# EAGLE schematic Roland+memser (EAGLE 6.6.0)

## Sheet 1 of 5
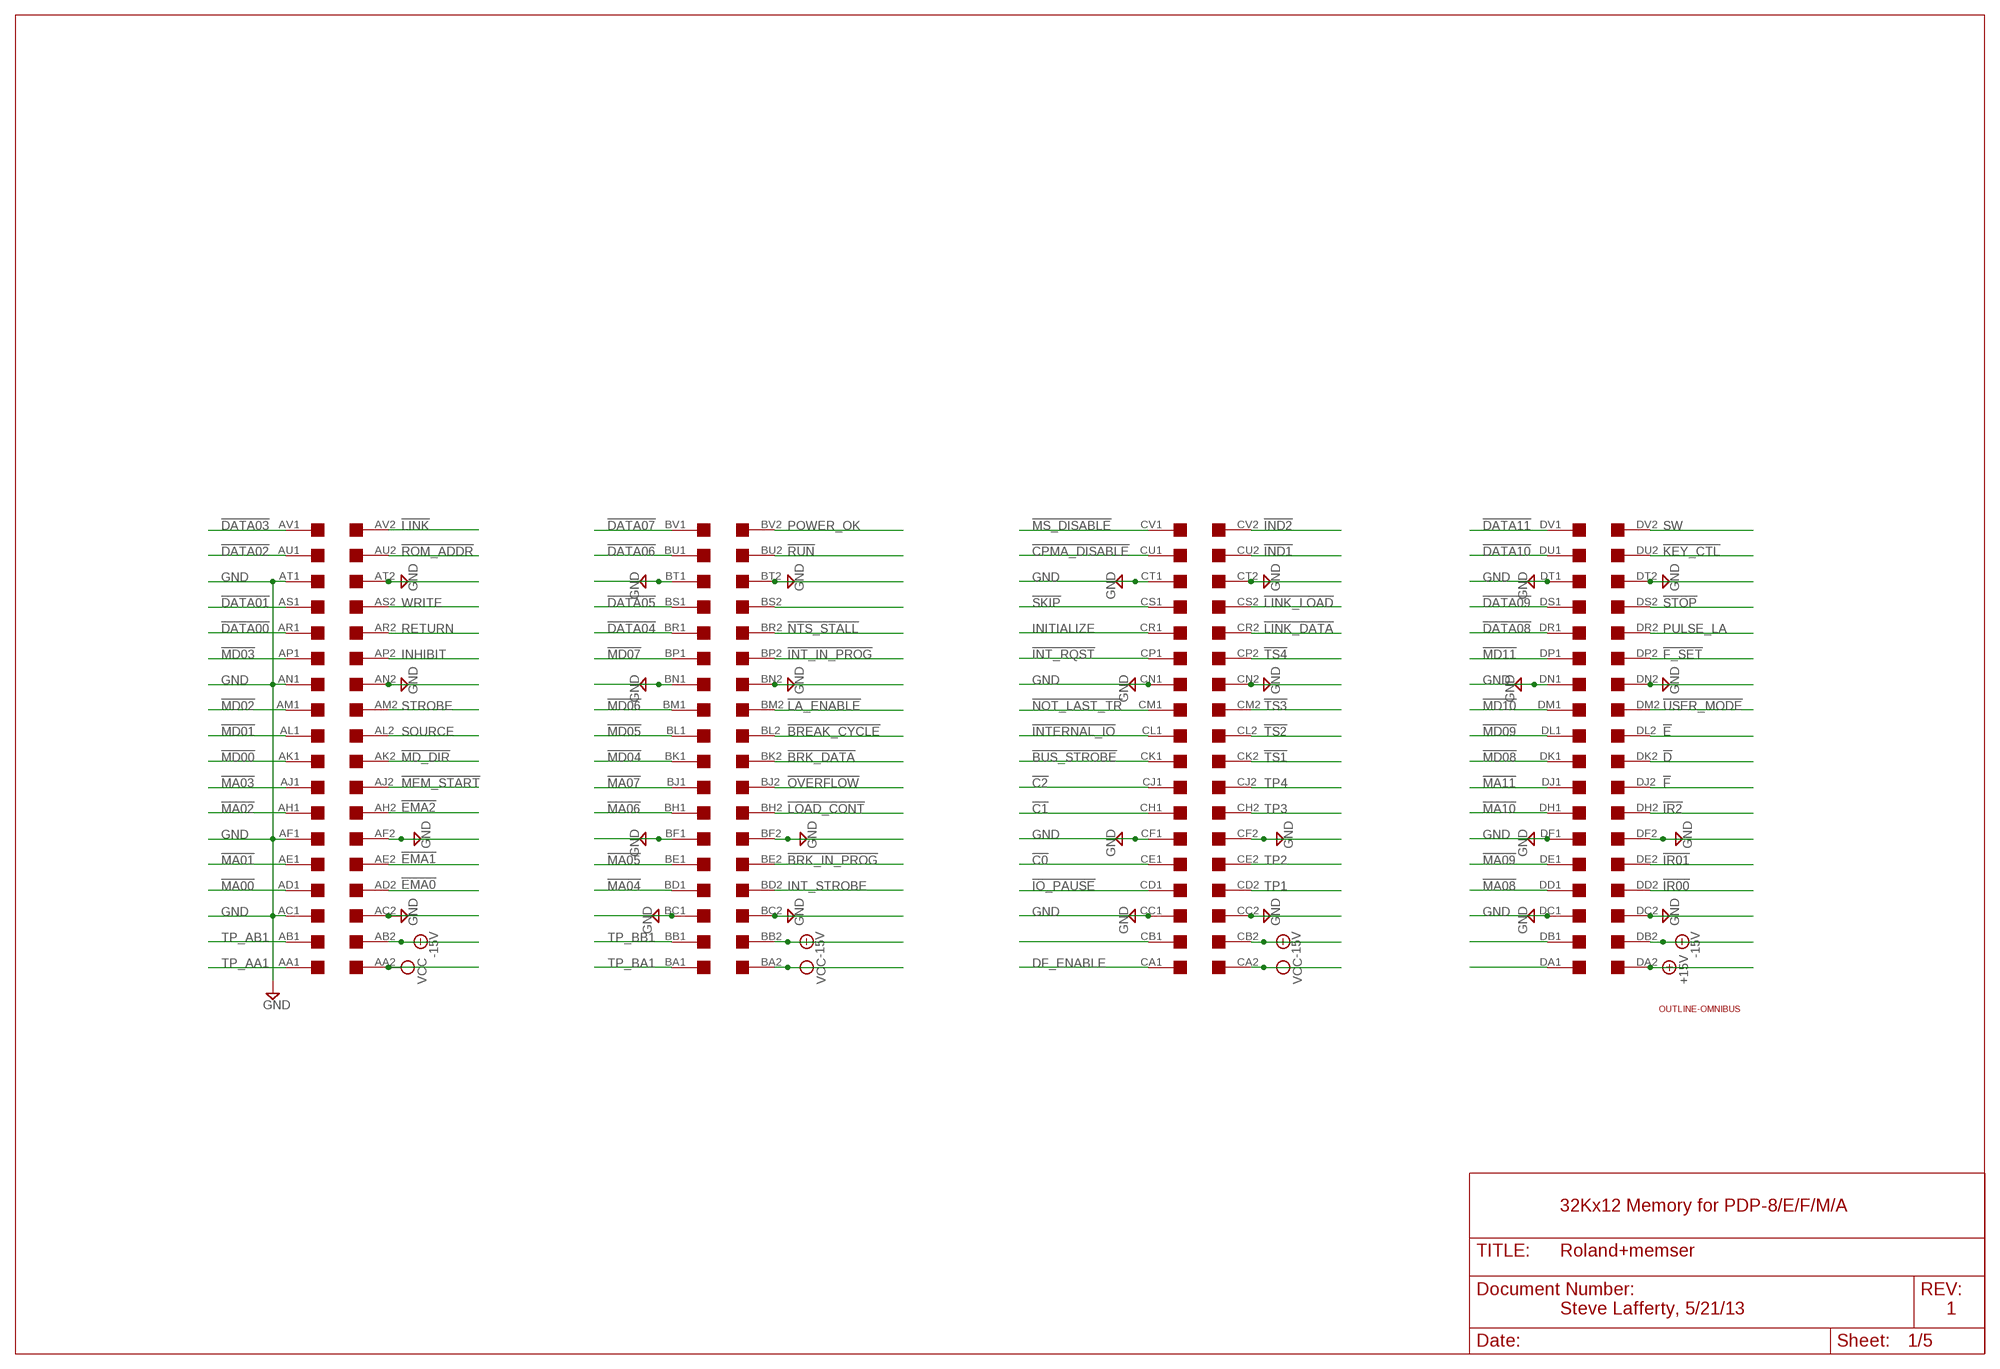
[diagram p0: schematic, sheet 1]

### Parts
J1  EDGE  QUAD  [EDGE-CON8]
U$1  OUTLINE-OMNIBUS  [OMNIBUS]

### Nets
!BREAK_CYCLE: J1.BL2
!BRK_DATA: J1.BK2 ; also sheet 2
!BRK_IN_PROG: J1.BE2
!BUS_STROBE: J1.CK1
!C0: J1.CE1 ; also sheet 5
!C1: J1.CH1 ; also sheet 5
!C2: J1.CJ1
!CPMA_DISABLE: J1.CU1 ; also sheet 5
!D: J1.DK2 ; also sheet 5
!DATA00: J1.AR1 ; also sheet 2,5
!DATA01: J1.AS1 ; also sheet 2,5
!DATA02: J1.AU1 ; also sheet 2,5
!DATA03: J1.AV1 ; also sheet 2,5
!DATA04: J1.BR1 ; also sheet 2,5
!DATA05: J1.BS1 ; also sheet 2,5
!DATA06: J1.BU1 ; also sheet 2,5
!DATA07: J1.BV1 ; also sheet 2,5
!DATA08: J1.DR1 ; also sheet 2,5
!DATA09: J1.DS1 ; also sheet 2,5
!DATA10: J1.DU1 ; also sheet 2,5
!DATA11: J1.DV1 ; also sheet 2,5
!E: J1.DL2
!EMA0: J1.AD2 ; also sheet 3,5
!EMA1: J1.AE2 ; also sheet 3,5
!EMA2: J1.AH2 ; also sheet 3,5
!F: J1.DJ2 ; also sheet 5
!F_SET: J1.DP2 ; also sheet 5
!IND1: J1.CU2 ; also sheet 5
!IND2: J1.CV2 ; also sheet 5
!INT_IN_PROG: J1.BP2 ; also sheet 5
!INT_RQST: J1.CP1 ; also sheet 5
!INTERNAL_IO: J1.CL1 ; also sheet 5
!IO_PAUSE: J1.CD1 ; also sheet 5
!IR00: J1.DD2 ; also sheet 5
!IR01: J1.DE2 ; also sheet 5
!IR2: J1.DH2
!KEY_CTL: J1.DU2 ; also sheet 2,5
!LA_ENABLE: J1.BM2 ; also sheet 2
!LINK: J1.AV2
!LINK_DATA: J1.CR2
!LINK_LOAD: J1.CS2
!LOAD_CONT: J1.BH2 ; also sheet 5
!MA00: J1.AD1 ; also sheet 3
!MA01: J1.AE1 ; also sheet 3
!MA02: J1.AH1 ; also sheet 3
!MA03: J1.AJ1 ; also sheet 3
!MA04: J1.BD1 ; also sheet 3
!MA05: J1.BE1 ; also sheet 3
!MA06: J1.BH1 ; also sheet 3
!MA07: J1.BJ1 ; also sheet 3
!MA08: J1.DD1 ; also sheet 3
!MA09: J1.DE1 ; also sheet 3
!MA10: J1.DH1 ; also sheet 3
!MA11: J1.DJ1 ; also sheet 3
!MD00: J1.AK1 ; also sheet 3,5
!MD01: J1.AL1 ; also sheet 3,5
!MD02: J1.AM1 ; also sheet 3,5
!MD03: J1.AP1 ; also sheet 3,5
!MD04: J1.BK1 ; also sheet 3,5
!MD05: J1.BL1 ; also sheet 3,5
!MD06: J1.BM1 ; also sheet 3,5
!MD07: J1.BP1 ; also sheet 3,5
!MD08: J1.DK1 ; also sheet 3,5
!MD09: J1.DL1 ; also sheet 3,5
!MD10: J1.DM1 ; also sheet 3,5
!MD11: J1.DP1 ; also sheet 3,5
!MD_DIR: J1.AK2 ; also sheet 2,3
!MEM_START: J1.AJ2 ; also sheet 2
!MS_DISABLE: J1.CV1 ; also sheet 2
!NOT_LAST_TR: J1.CM1
!NTS_STALL: J1.BR2
!OVERFLOW: J1.BJ2
!ROM_ADDR: J1.AU2 ; also sheet 3
!RUN: J1.BU2 ; also sheet 2,5
!SKIP: J1.CS1 ; also sheet 5
!STOP: J1.DS2 ; also sheet 2
!TS1: J1.CK2 ; also sheet 5
!TS2: J1.CL2
!TS3: J1.CM2 ; also sheet 5
!TS4: J1.CP2 ; also sheet 2
!USER_MODE: J1.DM2 ; also sheet 5
+15V: J1.DA2
-15V [supply]: J1.AB2 J1.BB2 J1.CB2 J1.DB2
DF_ENABLE: J1.CA1 ; also sheet 5
GND [supply]: J1.AC1 J1.AC2 J1.AF1 J1.AF2 J1.AN1 J1.AN2 J1.AT1 J1.AT2 J1.BC1 J1.BC2 J1.BF1 J1.BF2 J1.BN1 J1.BN2 J1.BT1 J1.BT2 J1.CC1 J1.CC2 J1.CF1 J1.CF2 J1.CN1 J1.CN2 J1.CT1 J1.CT2 J1.DC1 J1.DC2 J1.DF1 J1.DF2 J1.DN1 J1.DN2 J1.DT1 J1.DT2 ; also sheet 2,3,4,5
INHIBIT: J1.AP2
INITIALIZE: J1.CR1 ; also sheet 2,5
INT_STROBE: J1.BD2
N$51: J1.BS2
N$52: J1.CB1
N$53: J1.DA1
N$54: J1.DB1
POWER_OK: J1.BV2 ; also sheet 3,5
PULSE_LA: J1.DR2 ; also sheet 2,5
RETURN: J1.AR2
SOURCE: J1.AL2 ; also sheet 3
STROBE: J1.AM2
SW: J1.DV2 ; also sheet 2
TP1: J1.CD2
TP2: J1.CE2 ; also sheet 5
TP3: J1.CH2 ; also sheet 5
TP4: J1.CJ2 ; also sheet 2,3,5
TP_AA1: J1.AA1 ; also sheet 5
TP_AB1: J1.AB1 ; also sheet 5
TP_BA1: J1.BA1 ; also sheet 5
TP_BB1: J1.BB1 ; also sheet 5
VCC [supply]: J1.AA2 J1.BA2 J1.CA2 ; also sheet 2,3,5
WRITE: J1.AS2 ; also sheet 3

### Notes on the sheet
- 32Kx12 Memory for PDP-8/E/F/M/A
- Steve Lafferty, 5/21/13 | 1

## Sheet 2 of 5
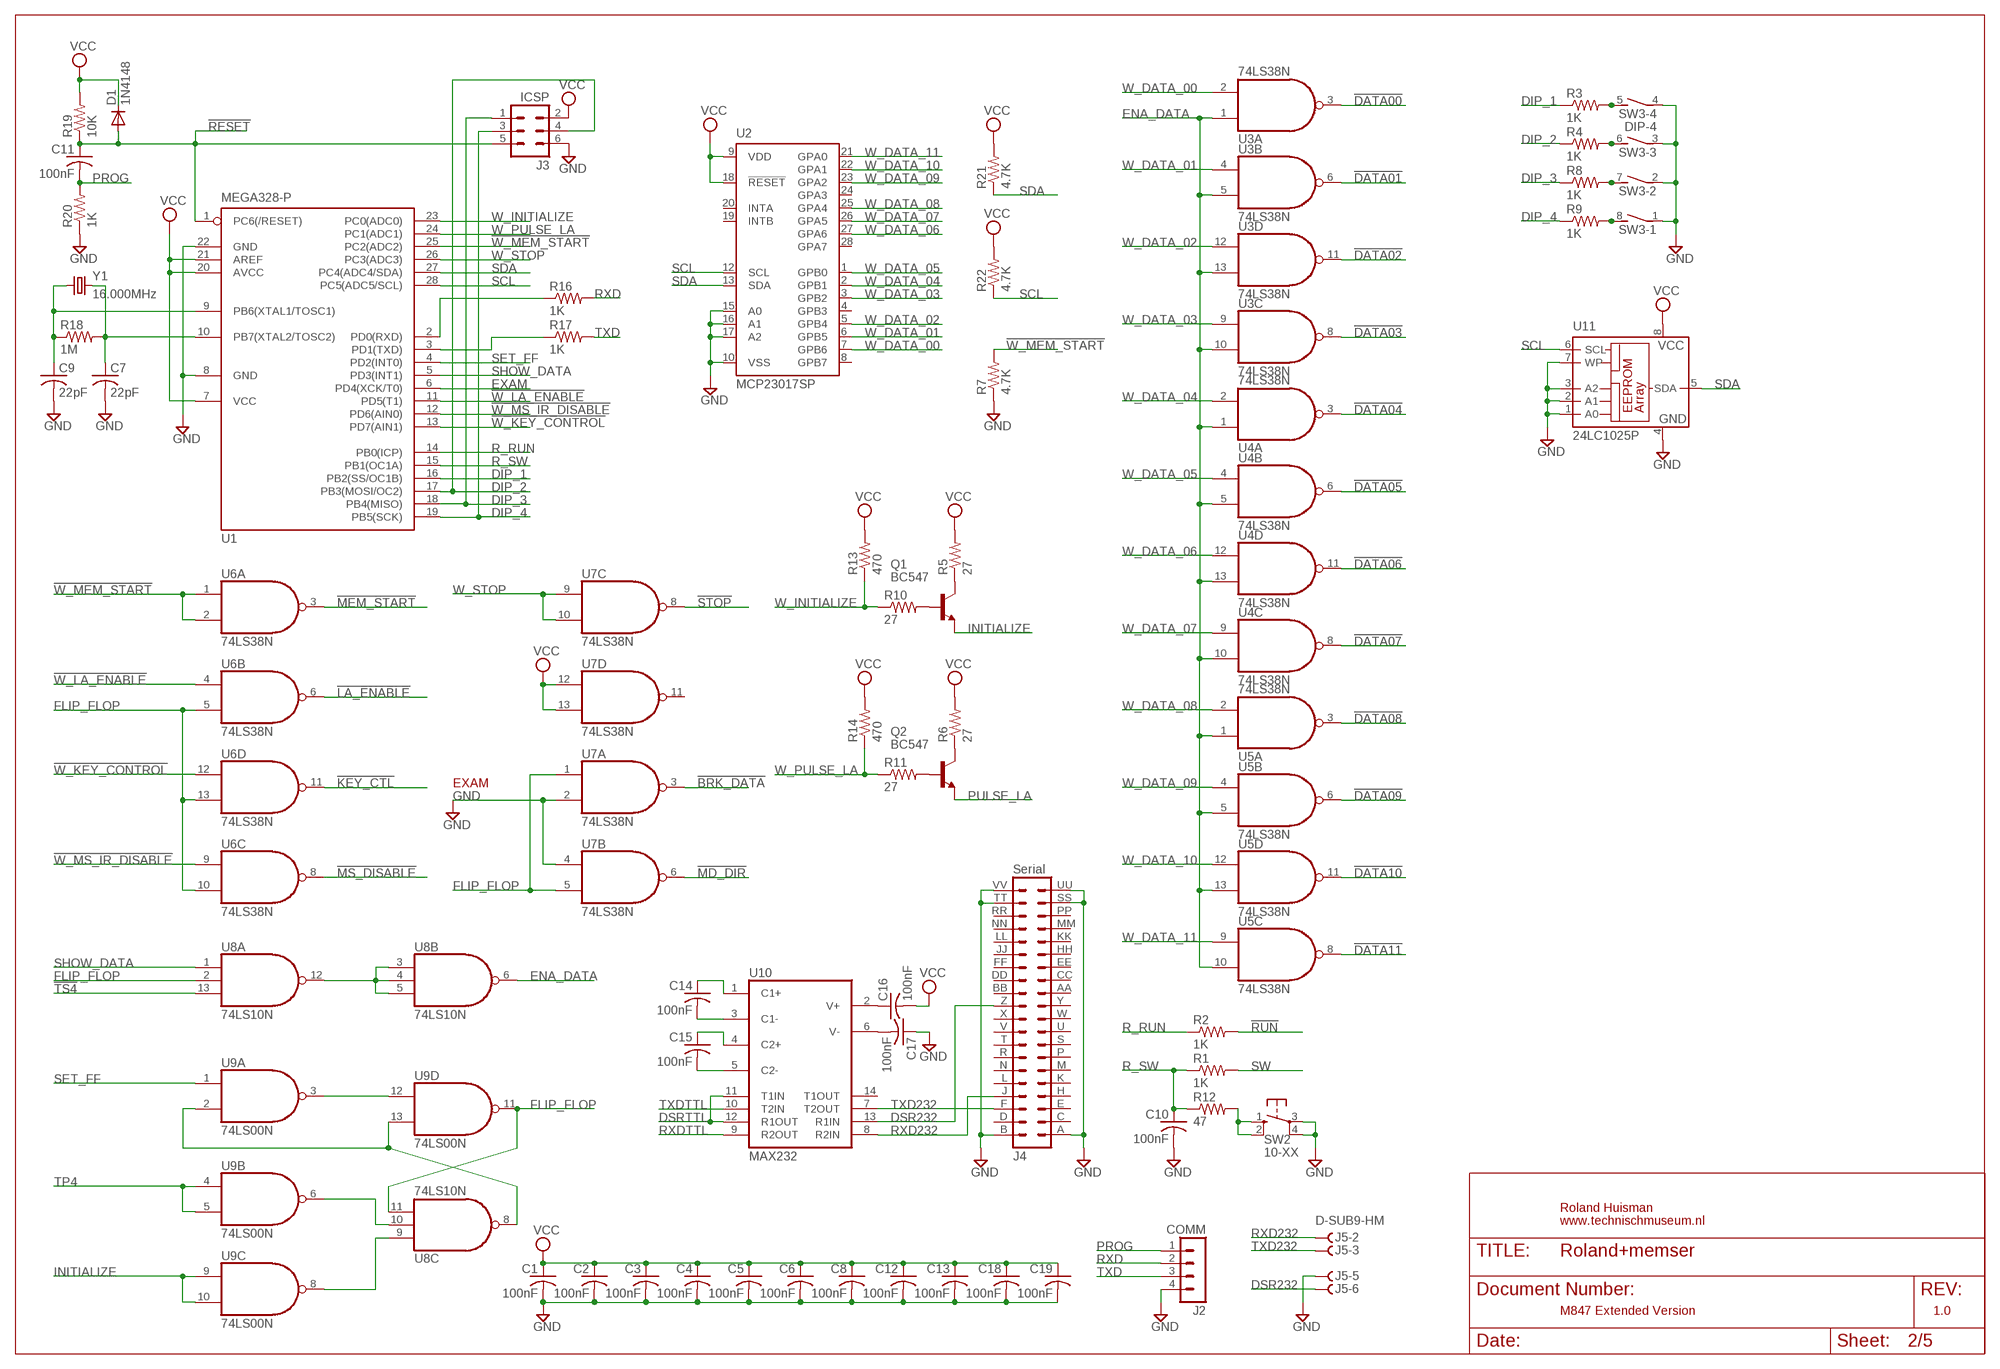
[diagram p1: schematic, sheet 2]

### Parts
C1  100nF  C-US050-025X075  [C050-025X075]
C2  100nF  C-US050-025X075  [C050-025X075]
C3  100nF  C-US050-025X075  [C050-025X075]
C4  100nF  C-US050-025X075  [C050-025X075]
C5  100nF  C-US050-025X075  [C050-025X075]
C6  100nF  C-US050-025X075  [C050-025X075]
C7  22pF  C-US050-025X075  [C050-025X075]
C8  100nF  C-US050-025X075  [C050-025X075]
C9  22pF  C-US050-025X075  [C050-025X075]
C10  100nF  C-US050-025X075  [C050-025X075]
C11  100nF  C-US050-025X075  [C050-025X075]
C12  100nF  C-US050-025X075  [C050-025X075]
C13  100nF  C-US050-025X075  [C050-025X075]
C14  100nF  C-US050-025X075  [C050-025X075]
C15  100nF  C-US050-025X075  [C050-025X075]
C16  100nF  C-US050-025X075  [C050-025X075]
C17  100nF  C-US050-025X075  [C050-025X075]
C18  100nF  C-US050-025X075  [C050-025X075]
C19  100nF  C-US050-025X075  [C050-025X075]
D1  1N4148  1N4148DO35-10  [DO35-10]
J2  COMM  MA04-1  [MA04-1]
J3  ICSP  MA03-2  [MA03-2]
J4  Serial  DEC40PINH  [DEC40PINH]
J5  D-SUB9-HM  D-SUB9-H5M09RA  [H5M09RA]
Q1  BC547  -NPN-TO5  [TO5]
Q2  BC547  -NPN-TO5  [TO5]
R1  1K  R-US_0207/10  [0207/10]
R2  1K  R-US_0207/10  [0207/10]
R3  1K  R-US_0207/10  [0207/10]
R4  1K  R-US_0207/10  [0207/10]
R5  27  R-US_0207/10  [0207/10]
R6  27  R-US_0207/10  [0207/10]
R7  4.7K  R-US_0207/10  [0207/10]
R8  1K  R-US_0207/10  [0207/10]
R9  1K  R-US_0207/10  [0207/10]
R10  27  R-US_0207/10  [0207/10]
R11  27  R-US_0207/10  [0207/10]
R12  47  R-US_0207/10  [0207/10]
R13  470  R-US_0207/10  [0207/10]
R14  470  R-US_0207/10  [0207/10]
R16  1K  R-US_0207/10  [0207/10]
R17  1K  R-US_0207/10  [0207/10]
R18  1M  R-US_0207/10  [0207/10]
R19  10K  R-US_0207/10  [0207/10]
R20  1K  R-US_0207/10  [0207/10]
R21  4.7K  R-US_0207/10  [0207/10]
R22  4.7K  R-US_0207/10  [0207/10]
SW2  10-XX  [B3F-10XX]
SW3  DIP-4  DIP04S  [DIP04S]
U1  MEGA328-P  MEGA8-P  [DIL28-3]
U2  MCP23017SP  [DIL28-3]
U3  74LS38N  [DIL14]
U4  74LS38N  [DIL14]
U5  74LS38N  [DIL14]
U6  74LS38N  [DIL14]
U7  74LS38N  [DIL14]
U8  74LS10N  [DIL14]
U9  74LS00N  [DIL14]
U10  MAX232  [DIL16]
U11  24LC1025P  24LC025P  [DIL8]
Y1  16.000MHz  CRYSTALHC49U-H  [HC49U-H]

### Nets
!BRK_DATA: U7.3(A:O) ; also sheet 1
!DATA00: U3.3(A:O) ; also sheet 1,5
!DATA01: U3.6(B:O) ; also sheet 1,5
!DATA02: U3.11(D:O) ; also sheet 1,5
!DATA03: U3.8(C:O) ; also sheet 1,5
!DATA04: U4.3(A:O) ; also sheet 1,5
!DATA05: U4.6(B:O) ; also sheet 1,5
!DATA06: U4.11(D:O) ; also sheet 1,5
!DATA07: U4.8(C:O) ; also sheet 1,5
!DATA08: U5.3(A:O) ; also sheet 1,5
!DATA09: U5.6(B:O) ; also sheet 1,5
!DATA10: U5.11(D:O) ; also sheet 1,5
!DATA11: U5.8(C:O) ; also sheet 1,5
!KEY_CTL: U6.11(D:O) ; also sheet 1,5
!LA_ENABLE: U6.6(B:O) ; also sheet 1
!MD_DIR: U7.6(B:O) ; also sheet 1,3
!MEM_START: U6.3(A:O) ; also sheet 1
!MS_DISABLE: U6.8(C:O) ; also sheet 1
!RESET: C11.1 D1.A J3.5 R19.1 U1.1(PC6(/RESET))
!RUN: R2.2 ; also sheet 1,5
!STOP: U7.8(C:O) ; also sheet 1
!TS4: U8.13(A:I2) ; also sheet 1
!W_KEY_CONTROL: U1.13(PD7(AIN1)) U6.12(D:I0)
!W_LA_ENABLE: U1.11(PD5(T1)) U6.4(B:I0)
!W_MEM_START: R7.2 U1.25(PC2(ADC2)) U6.1(A:I0) U6.2(A:I1)
!W_MS_IR_DISABLE: U1.12(PD6(AIN0)) U6.9(C:I0)
DIP_1: R3.1 U1.16(PB2(SS/OC1B))
DIP_2: J3.4 R4.1 U1.17(PB3(MOSI/OC2))
DIP_3: J3.1 R8.1 U1.18(PB4(MISO))
DIP_4: J3.3 R9.1 U1.19(PB5(SCK))
DSR232: J4.Z J5.6 U10.13(R1IN)
DSRTTL: U10.11(T1IN) U10.12(R1OUT) ; also sheet 5
ENA_DATA: U3.1(A:I0) U3.5(B:I1) U3.10(C:I1) U3.13(D:I1) U4.1(A:I0) U4.5(B:I1) U4.10(C:I1) U4.13(D:I1) U5.1(A:I0) U5.5(B:I1) U5.10(C:I1) U5.13(D:I1) U8.6(B:O)
EXAM: U1.6(PD4(XCK/T0))
FLIP_FLOP: U6.5(B:I1) U6.10(C:I1) U6.13(D:I1) U7.1(A:I0) U7.5(B:I1) U8.2(A:I1) U8.11(C:I2) U9.11(D:O)
GND [supply]: C1.2 C2.2 C3.2 C4.2 C5.2 C6.2 C7.2 C8.2 C9.2 C10.2 C12.2 C13.2 C17.1 C18.2 C19.2 J2.4 J3.6 J4.A J4.B J4.SS J4.TT J4.UU J4.VV J5.5 R7.1 R20.1 SW2.3(P) SW2.4(P1) SW3.1 SW3.2 SW3.3 SW3.4 U1.8(GND) U1.22(GND) U2.10(VSS) U2.15(A0) U2.16(A1) U2.17(A2) U7.2(A:I1) U7.4(B:I0) U11.1(A0) U11.2(A1) U11.3(A2) U11.4(GND) U11.7(WP) ; also sheet 1,3,4,5
INITIALIZE: Q1.1(E) U9.9(C:I0) U9.10(C:I1) ; also sheet 1,5
N$1: C7.1 R18.2 U1.10(PB7(XTAL2/TOSC2)) Y1.1
N$2: C9.1 R18.1 U1.9(PB6(XTAL1/TOSC1)) Y1.2
N$4: Q1.3(C) R5.1
N$5: Q1.2(B) R10.2
N$6: Q2.3(C) R6.1
N$7: Q2.2(B) R11.2
N$8: U9.3(A:O) U9.12(D:I0)
N$9: U8.3(B:I0) U8.4(B:I1) U8.5(B:I2) U8.12(A:O)
N$10: U8.8(C:O) U9.2(A:I1) U9.13(D:I1)
N$12: R17.1 U1.3(PD1(TXD))
N$13: R16.1 U1.2(PD0(RXD))
N$14: U8.10(C:I1) U9.6(B:O)
N$15: U8.9(C:I0) U9.8(C:O)
N$16: C17.2 U10.6(V-)
N$17: C14.1 U10.1(C1+)
N$827: C14.2 U10.3(C1-)
N$914: C15.2 U10.5(C2-)
N$915: C15.1 U10.4(C2+)
N$916: C16.1 U10.2(V+)
N$918: R12.2 SW2.1(S) SW2.2(S1)
N$919: R3.2 SW3.5
N$920: R4.2 SW3.6
N$921: R8.2 SW3.7
N$922: R9.2 SW3.8
PROG: C11.2 J2.1 R20.2 ; also sheet 5
PULSE_LA: Q2.1(E) ; also sheet 1,5
R_RUN: R2.1 U1.14(PB0(ICP))
R_SW: C10.1 R1.1 R12.1 U1.15(PB1(OC1A))
RXD: J2.2 R16.2 ; also sheet 5
RXD232: J4.J J5.2 U10.8(R2IN)
RXDTTL: U10.9(R2OUT) ; also sheet 5
SCL: R22.1 U1.28(PC5(ADC5/SCL)) U2.12(SCL) U11.6(SCL)
SDA: R21.1 U1.27(PC4(ADC4/SDA)) U2.13(SDA) U11.5(SDA)
SET_FF: U1.4(PD2(INT0)) U9.1(A:I0)
SHOW_DATA: U1.5(PD3(INT1)) U8.1(A:I0)
SW: R1.2 ; also sheet 1
TP4: U9.4(B:I0) U9.5(B:I1) ; also sheet 1,3,5
TXD: J2.3 R17.2 ; also sheet 5
TXD232: J4.F J5.3 U10.7(T2OUT)
TXDTTL: U10.10(T2IN) ; also sheet 5
VCC [supply]: C1.1 C2.1 C3.1 C4.1 C5.1 C6.1 C8.1 C12.1 C13.1 C16.2 C18.1 C19.1 D1.C J3.2 R5.2 R6.2 R13.2 R14.2 R19.2 R21.2 R22.2 U1.7(VCC) U1.20(AVCC) U1.21(AREF) U2.9(VDD) U2.18(!RESET) U7.12(D:I0) U7.13(D:I1) U11.8(VCC) ; also sheet 1,3,5
W_DATA_00: U2.7(GPB6) U3.2(A:I1)
W_DATA_01: U2.6(GPB5) U3.4(B:I0)
W_DATA_02: U2.5(GPB4) U3.12(D:I0)
W_DATA_03: U2.3(GPB2) U3.9(C:I0)
W_DATA_04: U2.2(GPB1) U4.2(A:I1)
W_DATA_05: U2.1(GPB0) U4.4(B:I0)
W_DATA_06: U2.27(GPA6) U4.12(D:I0)
W_DATA_07: U2.26(GPA5) U4.9(C:I0)
W_DATA_08: U2.25(GPA4) U5.2(A:I1)
W_DATA_09: U2.23(GPA2) U5.4(B:I0)
W_DATA_10: U2.22(GPA1) U5.12(D:I0)
W_DATA_11: U2.21(GPA0) U5.9(C:I0)
W_INITIALIZE: R10.1 R13.1 U1.23(PC0(ADC0))
W_PULSE_LA: R11.1 R14.1 U1.24(PC1(ADC1))
W_STOP: U1.26(PC3(ADC3)) U7.9(C:I0) U7.10(C:I1)
Unconnected: J4.AA J4.BB J4.C J4.CC J4.D J4.DD J4.E J4.EE J4.FF J4.H J4.HH J4.JJ J4.K J4.KK J4.L J4.LL J4.M J4.MM J4.N J4.NN J4.P J4.PP J4.R J4.RR J4.S J4.T J4.U J4.V J4.W J4.X J4.Y J5.1 J5.4 J5.7 J5.8 J5.9 U2.4(GPB3) U2.8(GPB7) U2.19(INTB) U2.20(INTA) U2.24(GPA3) U2.28(GPA7) U7.11(D:O) U10.14(T1OUT)

### Notes on the sheet
- EXAM
- Roland Huisman
- D-SUB9-HM | www.technischmuseum.nl
- M847 Extended Version | 1.0

## Sheet 3 of 5
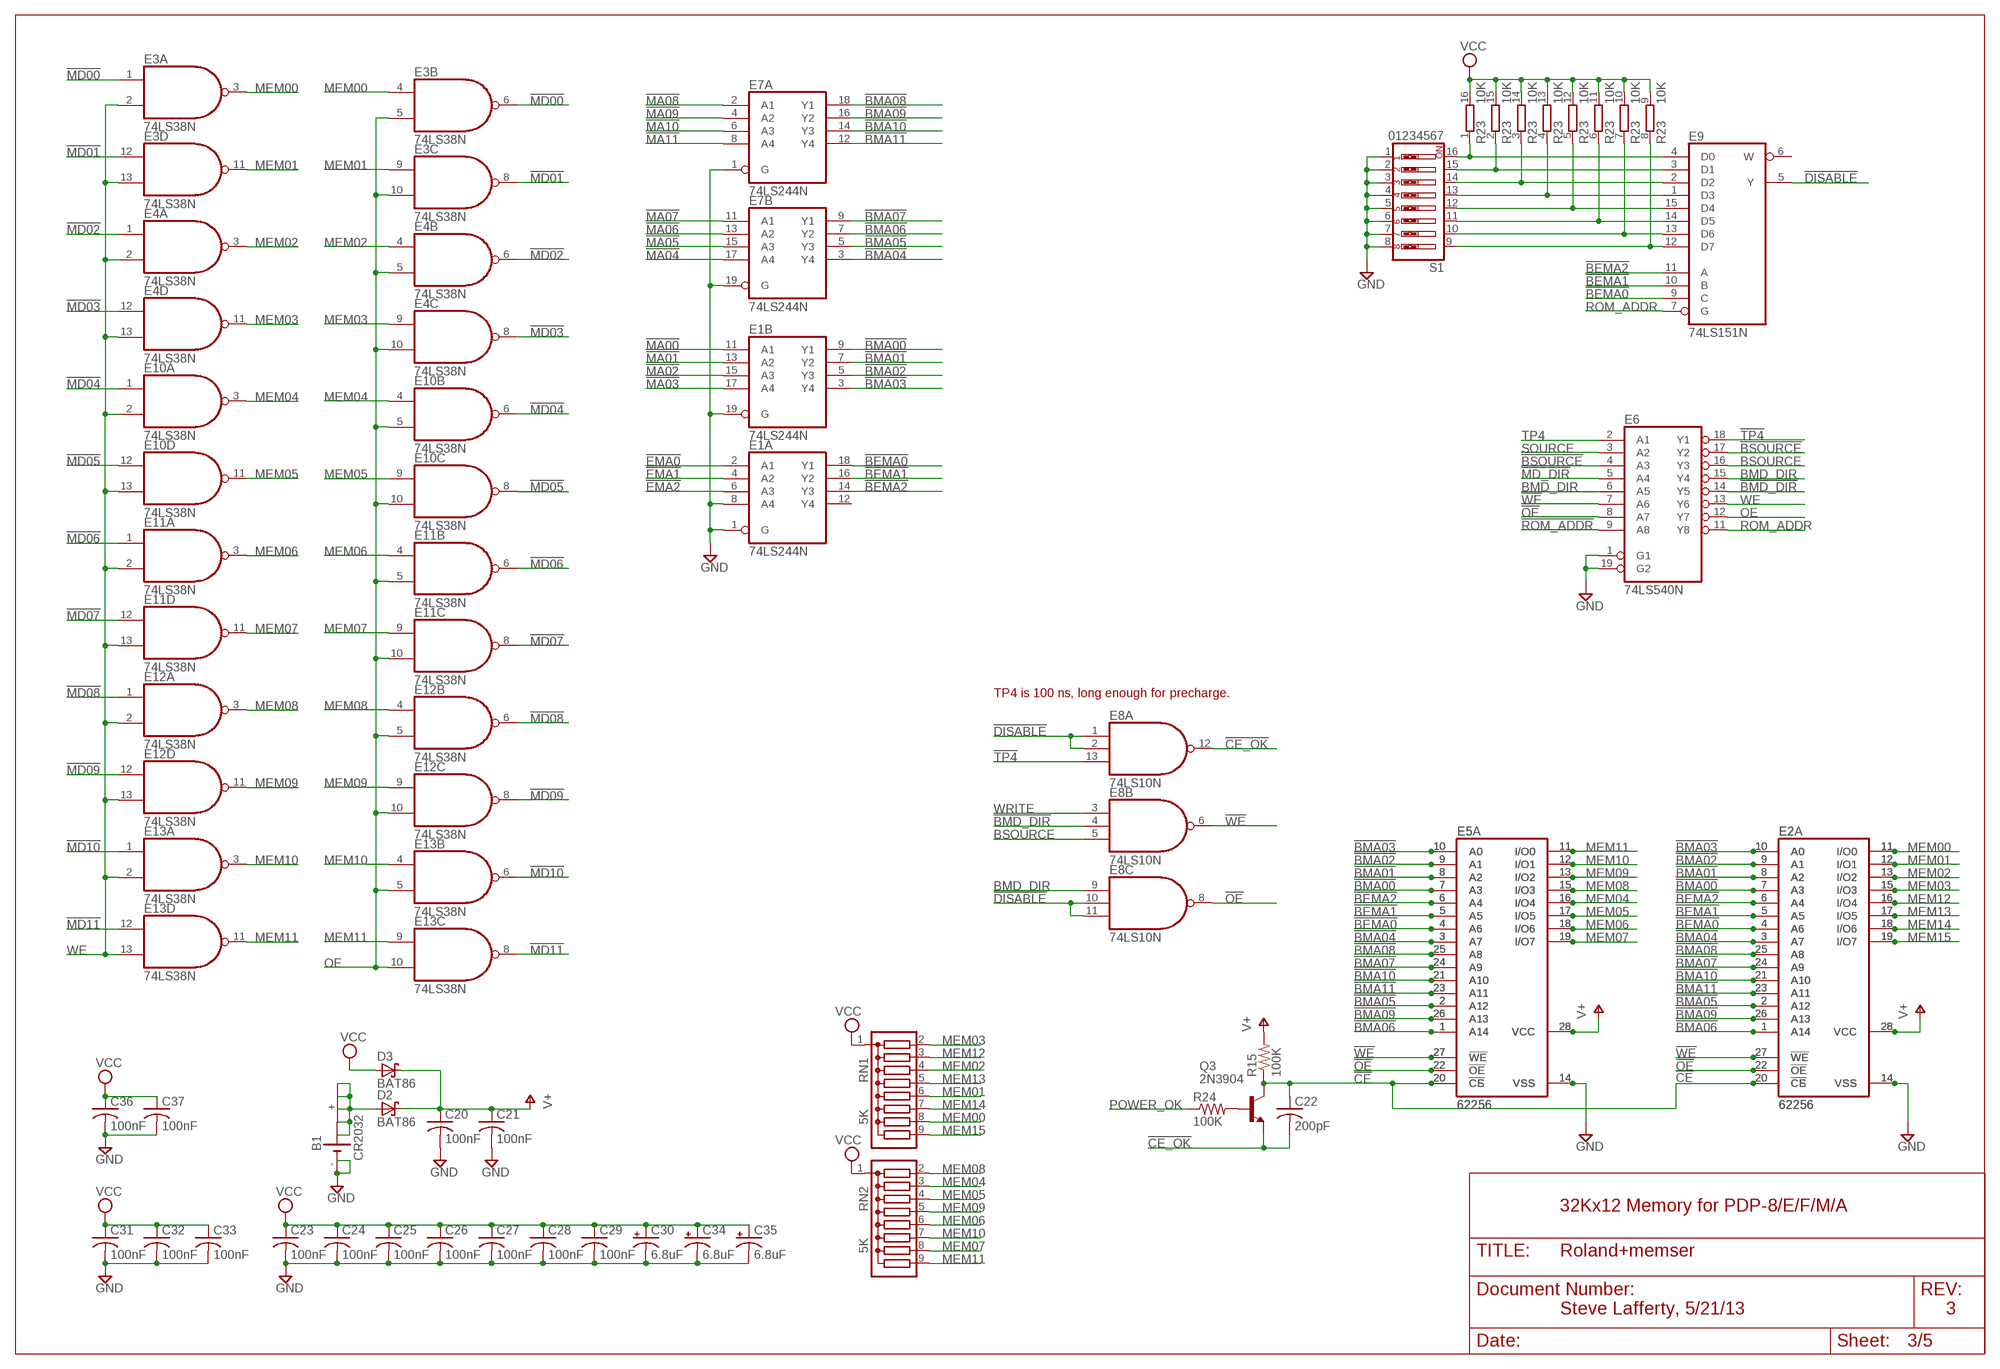
[diagram p2: schematic, sheet 3]

### Parts
B1  CR2032  B2430UNI  [B2430UNI]
C20  100nF  C-US050-025X075  [C050-025X075]
C21  100nF  C-US050-025X075  [C050-025X075]
C22  200pF  C-US050-025X075  [C050-025X075]
C23  100nF  C-US050-025X075  [C050-025X075]
C24  100nF  C-US050-025X075  [C050-025X075]
C25  100nF  C-US050-025X075  [C050-025X075]
C26  100nF  C-US050-025X075  [C050-025X075]
C27  100nF  C-US050-025X075  [C050-025X075]
C28  100nF  C-US050-025X075  [C050-025X075]
C29  100nF  C-US050-025X075  [C050-025X075]
C30  6.8uF  CPOL-USE20-8AXIAL  [E12-8]
C31  100nF  C-US050-025X075  [C050-025X075]
C32  100nF  C-US050-025X075  [C050-025X075]
C33  100nF  C-US050-025X075  [C050-025X075]
C34  6.8uF  CPOL-USE20-8AXIAL  [E12-8]
C35  6.8uF  CPOL-USE20-8AXIAL  [E12-8]
C36  100nF  C-US050-025X075  [C050-025X075]
C37  100nF  C-US050-025X075  [C050-025X075]
D2  BAT86  BAT19  [DO35-10]
D3  BAT86  BAT19  [DO35-10]
E1  74LS244N  [DIL20]
E2  62256  58C256P  [DIL28-6]
E2A  62256  62832P  [DIL28-3]
E3  74LS38N  [DIL14]
E4  74LS38N  [DIL14]
E5  62256  58C256P  [DIL28-6]
E5A  62256  62832P  [DIL28-3]
E6  74LS540N  [DIL20]
E7  74LS244N  [DIL20]
E8  74LS10N  [DIL14]
E9  74LS151N  [DIL16]
E10  74LS38N  [DIL14]
E11  74LS38N  [DIL14]
E12  74LS38N  [DIL14]
E13  74LS38N  [DIL14]
Q3  2N3904  [TO92]
R15  100K  R-US_0207/10  [0207/10]
R23  10K  8R-P  [DIL16]
R24  100K  R-US_0207/10  [0207/10]
RN1  5K  G08R  [SIL9]
RN2  5K  G08R  [SIL9]
S1  01234567  SW_DIP-8  [EDG-08]

### Nets
!BEMA0: E1.18(A:Y1) E2.4(A6) E2A.4(A6) E5.4(A6) E5A.4(A6) E9.9(C)
!BEMA1: E1.16(A:Y2) E2.5(A5) E2A.5(A5) E5.5(A5) E5A.5(A5) E9.10(B)
!BEMA2: E1.14(A:Y3) E2.6(A4) E2A.6(A4) E5.6(A4) E5A.6(A4) E9.11(A)
!BMA00: E1.9(B:Y1) E2.7(A3) E2A.7(A3) E5.7(A3) E5A.7(A3)
!BMA01: E1.7(B:Y2) E2.8(A2) E2A.8(A2) E5.8(A2) E5A.8(A2)
!BMA02: E1.5(B:Y3) E2.9(A1) E2A.9(A1) E5.9(A1) E5A.9(A1)
!BMA03: E1.3(B:Y4) E2.10(A0) E2A.10(A0) E5.10(A0) E5A.10(A0)
!BMA04: E2.3(A7) E2A.3(A7) E5.3(A7) E5A.3(A7) E7.3(B:Y4)
!BMA05: E2.2(A12) E2A.2(A12) E5.2(A12) E5A.2(A12) E7.5(B:Y3)
!BMA06: E2.1(A14) E2A.1(A14) E5.1(A14) E5A.1(A14) E7.7(B:Y2)
!BMA07: E2.24(A9) E2A.24(A9) E5.24(A9) E5A.24(A9) E7.9(B:Y1)
!BMA08: E2.25(A8) E2A.25(A8) E5.25(A8) E5A.25(A8) E7.18(A:Y1)
!BMA09: E2.26(A13) E2A.26(A13) E5.26(A13) E5A.26(A13) E7.16(A:Y2)
!BMA10: E2.21(A10) E2A.21(A10) E5.21(A10) E5A.21(A10) E7.14(A:Y3)
!BMA11: E2.23(A11) E2A.23(A11) E5.23(A11) E5A.23(A11) E7.12(A:Y4)
!BMD_DIR: E6.14(Y5) E8.4(B:I1)
!BSOURCE: E6.4(A3) E6.17(Y2)
!CE: C22.1 E2.20(!CE) E2A.20(!CS) E5.20(!CE) E5A.20(!CS) Q3.1(C) R15.1
!CE_OK: C22.2 E8.12(A:O) Q3.3(E)
!DISABLE: E8.1(A:I0) E8.2(A:I1) E8.10(C:I1) E8.11(C:I2) E9.5(Y)
!EMA0: E1.2(A:A1) ; also sheet 1,5
!EMA1: E1.4(A:A2) ; also sheet 1,5
!EMA2: E1.6(A:A3) ; also sheet 1,5
!MA00: E1.11(B:A1) ; also sheet 1
!MA01: E1.13(B:A2) ; also sheet 1
!MA02: E1.15(B:A3) ; also sheet 1
!MA03: E1.17(B:A4) ; also sheet 1
!MA04: E7.17(B:A4) ; also sheet 1
!MA05: E7.15(B:A3) ; also sheet 1
!MA06: E7.13(B:A2) ; also sheet 1
!MA07: E7.11(B:A1) ; also sheet 1
!MA08: E7.2(A:A1) ; also sheet 1
!MA09: E7.4(A:A2) ; also sheet 1
!MA10: E7.6(A:A3) ; also sheet 1
!MA11: E7.8(A:A4) ; also sheet 1
!MD00: E3.1(A:I0) E3.6(B:O) ; also sheet 1,5
!MD01: E3.8(C:O) E3.12(D:I0) ; also sheet 1,5
!MD02: E4.1(A:I0) E4.6(B:O) ; also sheet 1,5
!MD03: E4.8(C:O) E4.12(D:I0) ; also sheet 1,5
!MD04: E10.1(A:I0) E10.6(B:O) ; also sheet 1,5
!MD05: E10.8(C:O) E10.12(D:I0) ; also sheet 1,5
!MD06: E11.1(A:I0) E11.6(B:O) ; also sheet 1,5
!MD07: E11.8(C:O) E11.12(D:I0) ; also sheet 1,5
!MD08: E12.1(A:I0) E12.6(B:O) ; also sheet 1,5
!MD09: E12.8(C:O) E12.12(D:I0) ; also sheet 1,5
!MD10: E13.1(A:I0) E13.6(B:O) ; also sheet 1,5
!MD11: E13.8(C:O) E13.12(D:I0) ; also sheet 1,5
!MD_DIR: E6.5(A4) ; also sheet 1,2
!OE: E2.22(!OE) E2A.22(!OE) E5.22(!OE) E5A.22(!OE) E6.8(A7) E8.8(C:O)
!ROM_ADDR: E6.9(A8) ; also sheet 1
!TP4: E6.18(Y1) E8.13(A:I2)
!WE: E2.27(!WE) E2A.27(!WE) E5.27(!WE) E5A.27(!WE) E6.7(A6) E8.6(B:O)
BMD_DIR: E6.6(A5) E6.15(Y4) E8.9(C:I0)
BSOURCE: E6.16(Y3) E8.5(B:I2)
GND [supply]: B1.- B1.-@1(-) C20.2 C21.2 C23.2 C24.2 C25.2 C26.2 C27.2 C28.2 C29.2 C30.- C31.2 C32.2 C33.2 C34.- C35.- C36.2 C37.2 E1.1(A:G) E1.8(A:A4) E1.19(B:G) E2.14(VSS) E2A.14(VSS) E5.14(VSS) E5A.14(VSS) E6.1(G1) E6.19(G2) E7.1(A:G) E7.19(B:G) S1.1 S1.2 S1.3 S1.4 S1.5 S1.6 S1.7 S1.8 ; also sheet 1,2,4,5
MEM00: E2.11(I/O0) E2A.11(I/O0) E3.3(A:O) E3.4(B:I0) RN1.8
MEM01: E2.12(I/O1) E2A.12(I/O1) E3.9(C:I0) E3.11(D:O) RN1.6
MEM02: E2.13(I/O2) E2A.13(I/O2) E4.3(A:O) E4.4(B:I0) RN1.4
MEM03: E2.15(I/O3) E2A.15(I/O3) E4.9(C:I0) E4.11(D:O) RN1.2
MEM04: E5.16(I/O4) E5A.16(I/O4) E10.3(A:O) E10.4(B:I0) RN2.3
MEM05: E5.17(I/O5) E5A.17(I/O5) E10.9(C:I0) E10.11(D:O) RN2.4
MEM06: E5.18(I/O6) E5A.18(I/O6) E11.3(A:O) E11.4(B:I0) RN2.6
MEM07: E5.19(I/O7) E5A.19(I/O7) E11.9(C:I0) E11.11(D:O) RN2.8
MEM08: E5.15(I/O3) E5A.15(I/O3) E12.3(A:O) E12.4(B:I0) RN2.2
MEM09: E5.13(I/O2) E5A.13(I/O2) E12.9(C:I0) E12.11(D:O) RN2.5
MEM10: E5.12(I/O1) E5A.12(I/O1) E13.3(A:O) E13.4(B:I0) RN2.7
MEM11: E5.11(I/O0) E5A.11(I/O0) E13.9(C:I0) E13.11(D:O) RN2.9
MEM12: E2.16(I/O4) E2A.16(I/O4) RN1.3
MEM13: E2.17(I/O5) E2A.17(I/O5) RN1.5
MEM14: E2.18(I/O6) E2A.18(I/O6) RN1.7
MEM15: E2.19(I/O7) E2A.19(I/O7) RN1.9
N$25: B1.+ B1.+@1(+) B1.+@2(+) B1.+@3(+) B1.+@4(+) D2.A
N$26: E9.1(D3) R23.4 S1.13
N$27: E9.2(D2) R23.3 S1.14
N$28: E9.15(D4) R23.5 S1.12
N$29: E9.14(D5) R23.6 S1.11
N$30: E9.13(D6) R23.7 S1.10
N$31: E9.12(D7) R23.8 S1.9
N$32: E9.4(D0) R23.1 S1.16
N$33: E9.3(D1) R23.2 S1.15
N$36: Q3.2(B) R24.2
OE: E3.5(B:I1) E3.10(C:I1) E4.5(B:I1) E4.10(C:I1) E6.12(Y7) E10.5(B:I1) E10.10(C:I1) E11.5(B:I1) E11.10(C:I1) E12.5(B:I1) E12.10(C:I1) E13.5(B:I1) E13.10(C:I1)
POWER_OK: R24.1 ; also sheet 1,5
ROM_ADDR: E6.11(Y8) E9.7(G)
SOURCE: E6.3(A2) ; also sheet 1
TP4: E6.2(A1) ; also sheet 1,2,5
V+: C20.1 C21.1 D2.C D3.C E2.28(VCC) E2A.28(VCC) E5.28(VCC) E5A.28(VCC) R15.2
VCC [supply]: C23.1 C24.1 C25.1 C26.1 C27.1 C28.1 C29.1 C30.+ C31.1 C32.1 C33.1 C34.+ C35.+ C36.1 C37.1 D3.A R23.9 R23.10 R23.11 R23.12 R23.13 R23.14 R23.15 R23.16 RN1.1 RN2.1 ; also sheet 1,2,5
WE: E3.2(A:I1) E3.13(D:I1) E4.2(A:I1) E4.13(D:I1) E6.13(Y6) E10.2(A:I1) E10.13(D:I1) E11.2(A:I1) E11.13(D:I1) E12.2(A:I1) E12.13(D:I1) E13.2(A:I1) E13.13(D:I1)
WRITE: E8.3(B:I0) ; also sheet 1
Unconnected: E1.12(A:Y4) E9.6(W)

### Notes on the sheet
- TP4 is 100 ns, long enough for precharge.
- 32Kx12 Memory for PDP-8/E/F/M/A
- Steve Lafferty, 5/21/13 | 3

## Sheet 4 of 5
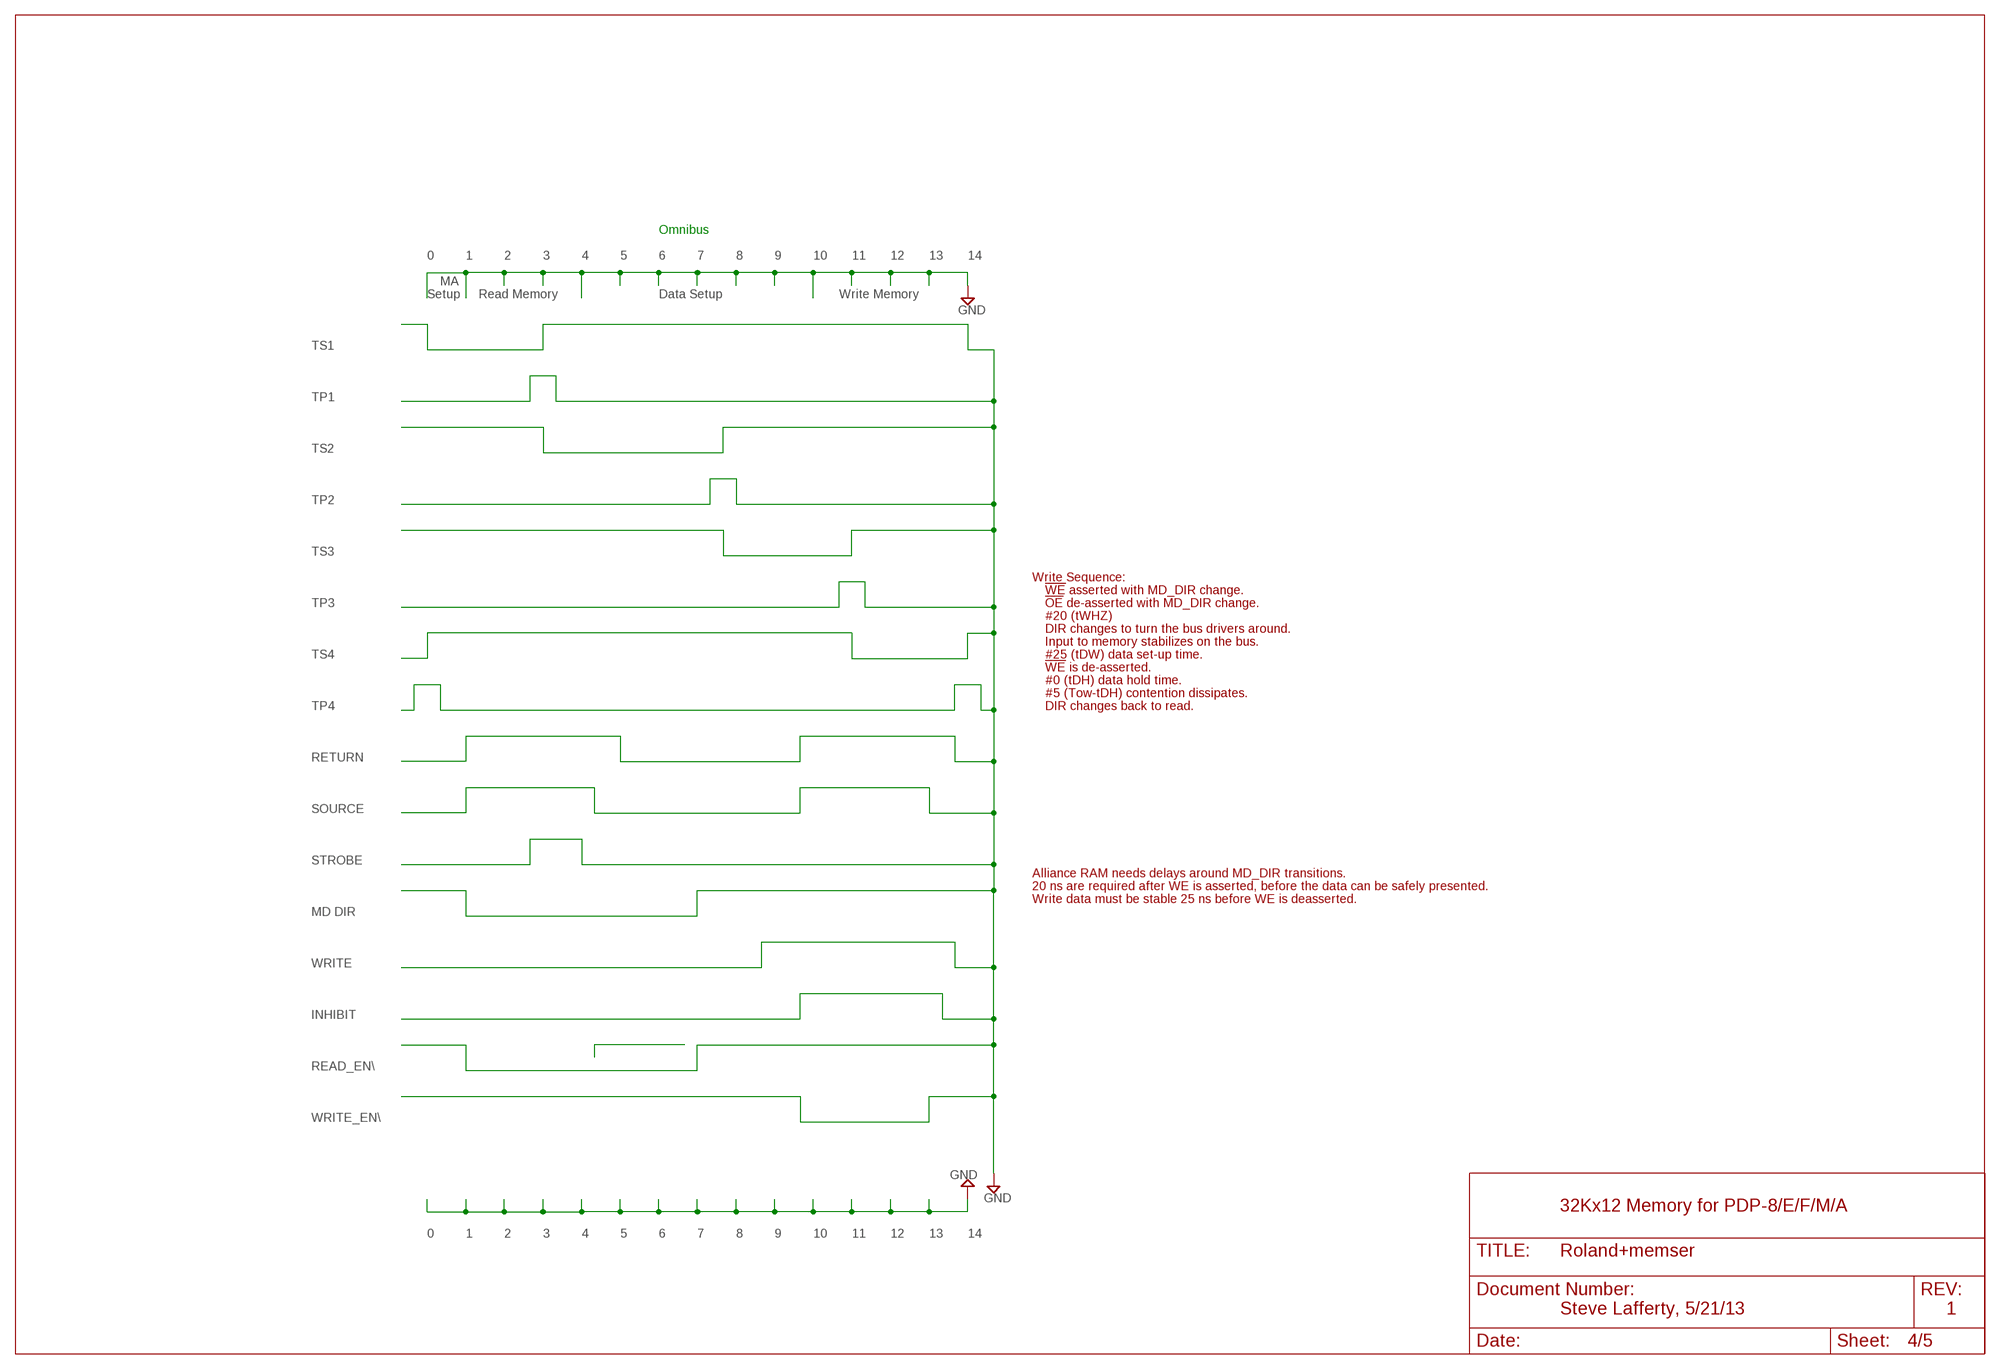
[diagram p3: schematic, sheet 4]

### Notes on the sheet
- Omnibus
- 0 | 1 | 2 | 3 | 4 | 5 | 6 | 7 | 8 | 9 | 10 | 11 | 12 | 13 | 14
- MA
- Setup | Read Memory | Data Setup | Write Memory
- TS1
- TP1
- TS2
- TP2
- TS3
- Write Sequence:
- !WE! asserted with MD_DIR change.
- TP3 | !OE! de-asserted with MD_DIR change.
- #20 (tWHZ)
- DIR changes to turn the bus drivers around.
- Input to memory stabilizes on the bus.
- TS4 | #25 (tDW) data set-up time.
- !WE! is de-asserted.
- #0 (tDH) data hold time.
- #5 (Tow-tDH) contention dissipates.
- TP4 | DIR changes back to read.
- RETURN
- SOURCE
- STROBE
- Alliance RAM needs delays around MD_DIR transitions.
- 20 ns are required after WE is asserted, before the data can be safely presented.
- Write data must be stable 25 ns before WE is deasserted.
- MD DIR
- WRITE
- INHIBIT
- READ_EN\\
- WRITE_EN\\
- 32Kx12 Memory for PDP-8/E/F/M/A
- 0 | 1 | 2 | 3 | 4 | 5 | 6 | 7 | 8 | 9 | 10 | 11 | 12 | 13 | 14
- Steve Lafferty, 5/21/13 | 1

## Sheet 5 of 5
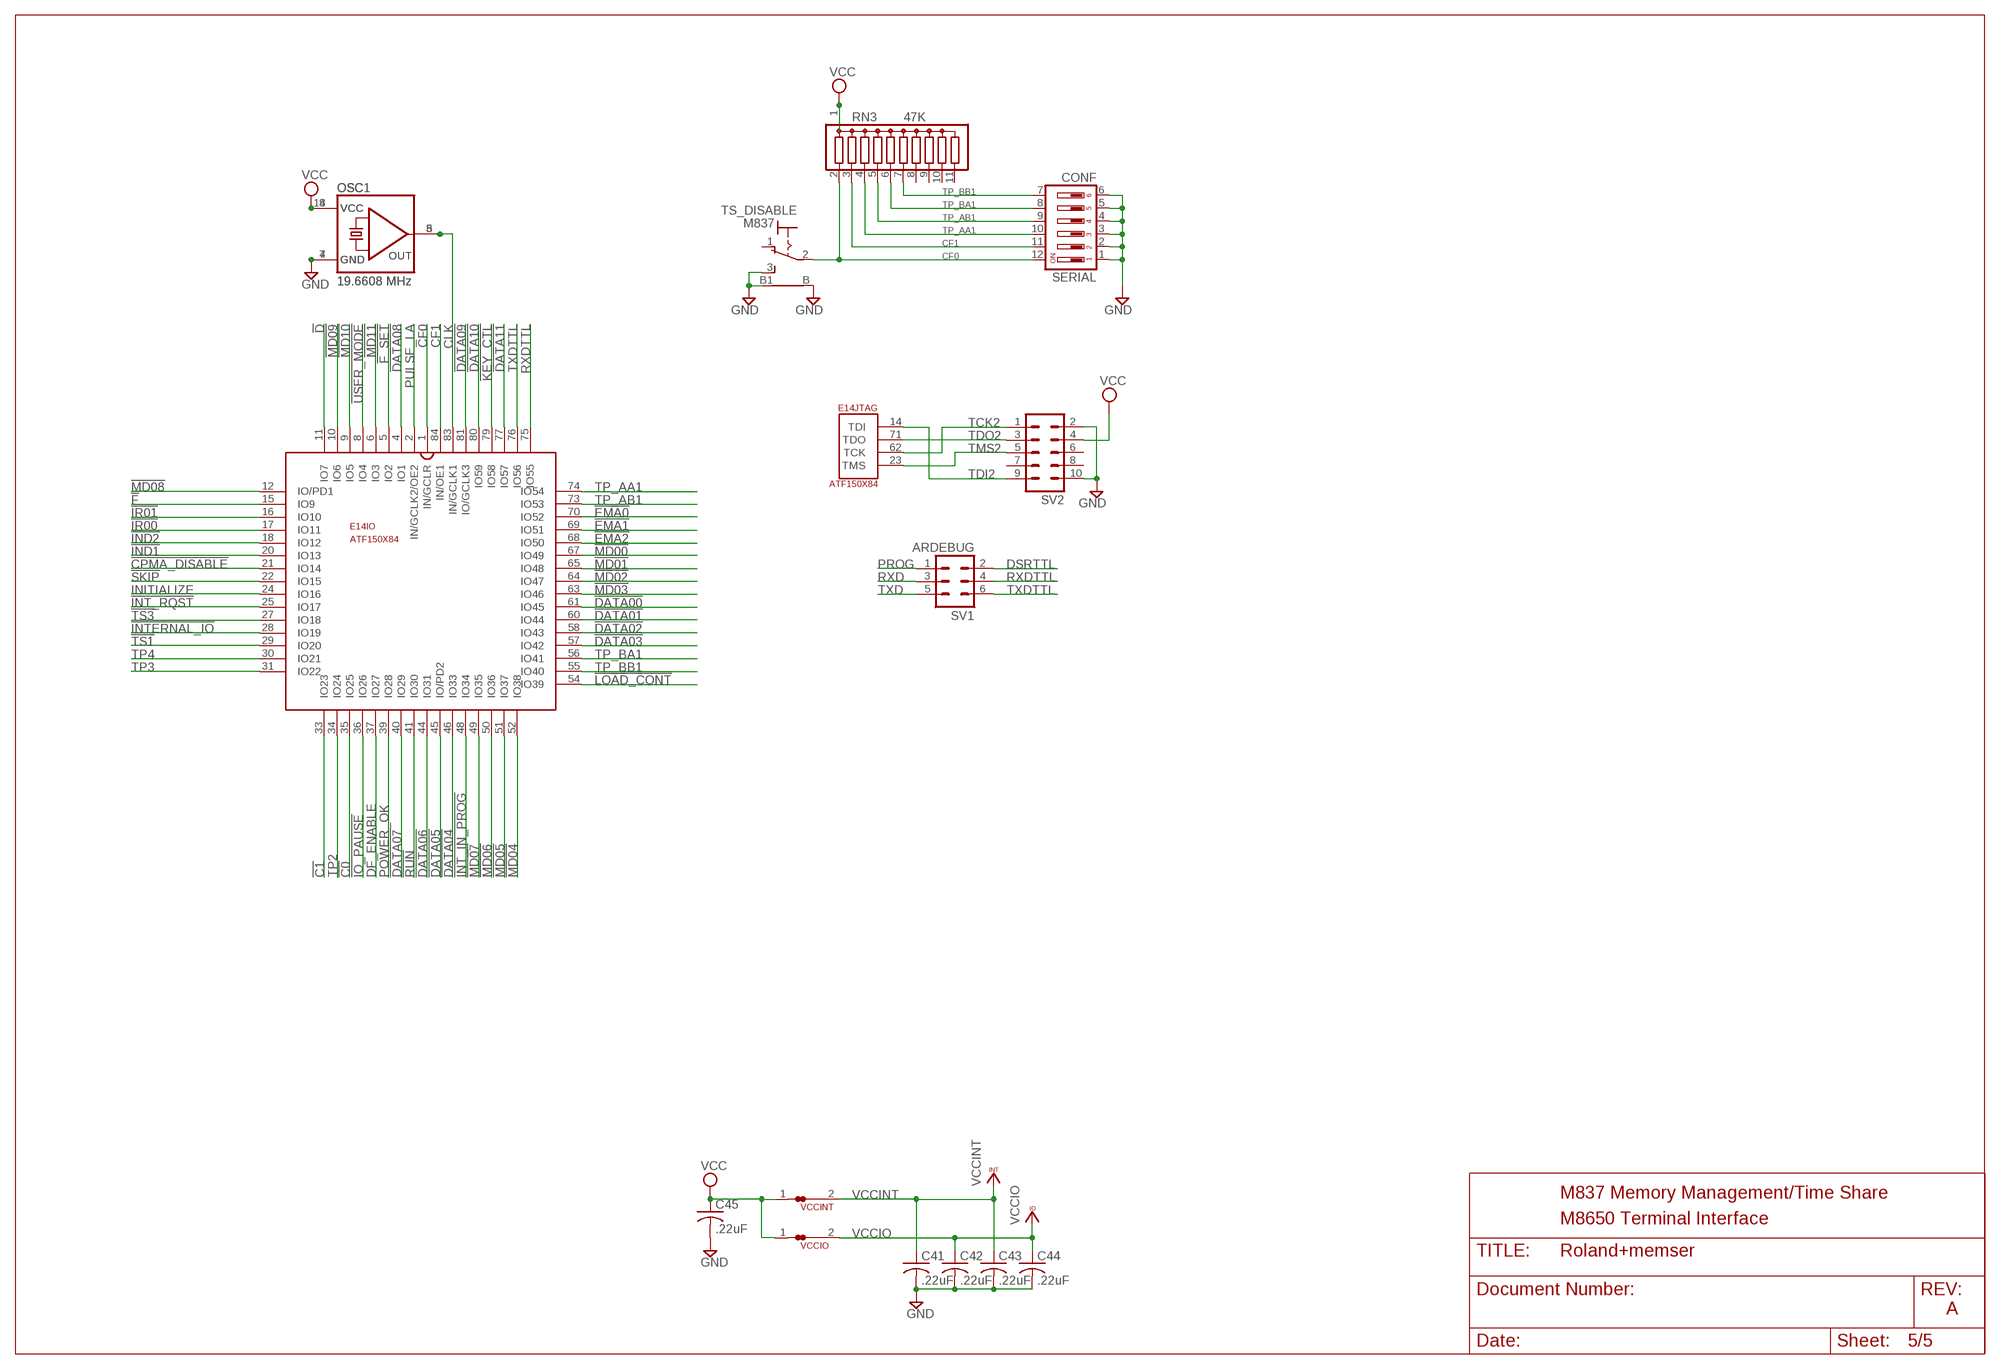
[diagram p4: schematic, sheet 5]

### Parts
C41  .22uF  C-US  [C063-025X075]
C42  .22uF  C-US  [C063-025X075]
C43  .22uF  C-US  [C063-025X075]
C44  .22uF  C-US  [C063-025X075]
C45  .22uF  C-US  [C063-025X075]
E14  ATF150X84  [S84]
OSC  19.6608 MHz  QG5460  [DIL08S]
OSC1  19.6608 MHz  QG5860  [DIL14S]
RN3  47K  G10R  [SIL11]
SERIAL  CONF  DP06  [DP-06]
SV1  ARDEBUG  MA03-2  [MA03-2]
SV2  ML10  [ML10]
TS_DISABLE  M837  9070-1W  [9070-1W]
VCCINT  JUMPER-NC1  [NC1]
VCCIO  JUMPER-NC1  [NC1]

### Nets
!C0: E14.35(IO:IO25) ; also sheet 1
!C1: E14.33(IO:IO23) ; also sheet 1
!CPMA_DISABLE: E14.21(IO:IO14) ; also sheet 1
!D: E14.11(IO:IO7) ; also sheet 1
!DATA00: E14.61(IO:IO45) ; also sheet 1,2
!DATA01: E14.60(IO:IO44) ; also sheet 1,2
!DATA02: E14.58(IO:IO43) ; also sheet 1,2
!DATA03: E14.57(IO:IO42) ; also sheet 1,2
!DATA04: E14.46(IO:IO33) ; also sheet 1,2
!DATA05: E14.45(IO:IO/PD2) ; also sheet 1,2
!DATA06: E14.44(IO:IO31) ; also sheet 1,2
!DATA07: E14.40(IO:IO29) ; also sheet 1,2
!DATA08: E14.4(IO:IO1) ; also sheet 1,2
!DATA09: E14.81(IO:IO/GCLK3) ; also sheet 1,2
!DATA10: E14.80(IO:IO59) ; also sheet 1,2
!DATA11: E14.77(IO:IO57) ; also sheet 1,2
!EMA0: E14.70(IO:IO52) ; also sheet 1,3
!EMA1: E14.69(IO:IO51) ; also sheet 1,3
!EMA2: E14.68(IO:IO50) ; also sheet 1,3
!F: E14.15(IO:IO9) ; also sheet 1
!F_SET: E14.5(IO:IO2) ; also sheet 1
!IND1: E14.20(IO:IO13) ; also sheet 1
!IND2: E14.18(IO:IO12) ; also sheet 1
!INT_IN_PROG: E14.48(IO:IO34) ; also sheet 1
!INT_RQST: E14.25(IO:IO17) ; also sheet 1
!INTERNAL_IO: E14.28(IO:IO19) ; also sheet 1
!IO_PAUSE: E14.36(IO:IO26) ; also sheet 1
!IR00: E14.17(IO:IO11) ; also sheet 1
!IR01: E14.16(IO:IO10) ; also sheet 1
!KEY_CTL: E14.79(IO:IO58) ; also sheet 1,2
!LOAD_CONT: E14.54(IO:IO39) ; also sheet 1
!MD00: E14.67(IO:IO49) ; also sheet 1,3
!MD01: E14.65(IO:IO48) ; also sheet 1,3
!MD02: E14.64(IO:IO47) ; also sheet 1,3
!MD03: E14.63(IO:IO46) ; also sheet 1,3
!MD04: E14.52(IO:IO38) ; also sheet 1,3
!MD05: E14.51(IO:IO37) ; also sheet 1,3
!MD06: E14.50(IO:IO36) ; also sheet 1,3
!MD07: E14.49(IO:IO35) ; also sheet 1,3
!MD08: E14.12(IO:IO/PD1) ; also sheet 1,3
!MD09: E14.10(IO:IO6) ; also sheet 1,3
!MD10: E14.9(IO:IO5) ; also sheet 1,3
!MD11: E14.6(IO:IO3) ; also sheet 1,3
!RUN: E14.41(IO:IO30) ; also sheet 1,2
!SKIP: E14.22(IO:IO15) ; also sheet 1
!TS1: E14.29(IO:IO20) ; also sheet 1
!TS3: E14.27(IO:IO18) ; also sheet 1
!USER_MODE: E14.8(IO:IO4) ; also sheet 1
CF0: E14.1(IO:IN/GCLR) RN3.2 SERIAL.12 TS_DISABLE.2(P)
CF1: E14.84(IO:IN/OE1) RN3.3 SERIAL.11
CLK: E14.83(IO:IN/GCLK1) OSC1.8(OUT) OSC.5(OUT)
DF_ENABLE: E14.37(IO:IO27) ; also sheet 1
DSRTTL: SV1.2 ; also sheet 2
GND [supply]: C41.2 C42.2 C43.2 C44.2 C45.2 OSC1.7(GND) OSC.4(GND) SERIAL.1 SERIAL.2 SERIAL.3 SERIAL.4 SERIAL.5 SERIAL.6 SV2.2 SV2.10 TS_DISABLE.3(S) TS_DISABLE.B TS_DISABLE.B1 ; also sheet 1,2,3,4
INITIALIZE: E14.24(IO:IO16) ; also sheet 1,2
POWER_OK: E14.39(IO:IO28) ; also sheet 1,3
PROG: SV1.1 ; also sheet 2
PULSE_LA: E14.2(IO:IN/GCLK2/OE2) ; also sheet 1,2
RXD: SV1.3 ; also sheet 2
RXDTTL: E14.75(IO:IO55) SV1.4 ; also sheet 2
TCK2: E14.62(JTAG:TCK) SV2.1
TDI2: E14.14(JTAG:TDI) SV2.9
TDO2: E14.71(JTAG:TDO) SV2.3
TMS2: E14.23(JTAG:TMS) SV2.5
TP2: E14.34(IO:IO24) ; also sheet 1
TP3: E14.31(IO:IO22) ; also sheet 1
TP4: E14.30(IO:IO21) ; also sheet 1,2,3
TP_AA1: E14.74(IO:IO54) RN3.4 SERIAL.10 ; also sheet 1
TP_AB1: E14.73(IO:IO53) RN3.5 SERIAL.9 ; also sheet 1
TP_BA1: E14.56(IO:IO41) RN3.6 SERIAL.8 ; also sheet 1
TP_BB1: E14.55(IO:IO40) RN3.7 SERIAL.7 ; also sheet 1
TXD: SV1.5 ; also sheet 2
TXDTTL: E14.76(IO:IO56) SV1.6 ; also sheet 2
VCC [supply]: C45.1 OSC1.14(VCC) OSC.8(VCC) RN3.1 SV2.4 VCCINT.1 VCCIO.1 ; also sheet 1,2,3
VCCINT [supply]: C41.1 C43.1 VCCINT.2
VCCIO [supply]: C42.1 C44.1 VCCIO.2
Unconnected: RN3.8 RN3.9 RN3.10 RN3.11 SV2.6 SV2.7 SV2.8 TS_DISABLE.1(O)

### Notes on the sheet
- M837 Memory Management/Time Share
- M8650 Terminal Interface
- A

## Power pins joined to a net without a drawn wire
GND: E1.10(P:GND) E3.7(P:GND) E4.7(P:GND) E6.10(GND) E7.10(P:GND) E8.7(P:GND) E9.8(GND) E10.7(P:GND) E11.7(P:GND) E12.7(P:GND) E13.7(P:GND) E14.7(GND) E14.19(GND) E14.32(GND) E14.42(GND) E14.47(GND) E14.59(GND) E14.72(GND) E14.82(GND) U3.7(P:GND) U4.7(P:GND) U5.7(P:GND) U6.7(P:GND) U7.7(P:GND) U8.7(P:GND) U9.7(P:GND) U10.15(GND)
VCC: E1.20(P:VCC) E3.14(P:VCC) E4.14(P:VCC) E6.20(VCC) E7.20(P:VCC) E8.14(P:VCC) E9.16(VCC) E10.14(P:VCC) E11.14(P:VCC) E12.14(P:VCC) E13.14(P:VCC) U3.14(P:VCC) U4.14(P:VCC) U5.14(P:VCC) U6.14(P:VCC) U7.14(P:VCC) U8.14(P:VCC) U9.14(P:VCC) U10.16(VCC)
VCCINT: E14.3(VCCINT) E14.43(VCCINT)
VCCIO: E14.13(VCCIO) E14.26(VCCIO) E14.38(VCCIO) E14.53(VCCIO) E14.66(VCCIO) E14.78(VCCIO)

## Library data of the parts
B1 = battery:B2430UNI: LI BATTERY
C1-C29 C31-C33 C36 C37 = rcl:C-US: CAPACITOR, American symbol
C30 C34 C35 = dec-con:CPOL-USE20-8AXIAL: A 0.8 inch electrolytic.
C41-C45 = dec-con:C-US: Capacitors with funky DEC lead spacing.
D1 = diode:1N4148: DIODE high speed (Philips)
D2 D3 = diode:BAT19: DIODE barrier diode
E1 E7 = 74xx-us:74*244: Octal BUFFER and LINE DRIVER, 3-state
E2 E5 = memory-hitachi:58C256P: MEMORY
E2A E5A = memory-hitachi:62832P: MEMORY; OC_FARNELL: unknown; OC_NEWARK: unknown
E3 E4 E10-E13 U3-U7 = dec-con:74*38: Quad 2-input NAND gate, open collector output
E6 = 74xx-us:74*540: Octal BUFFER and LINE DRIVER, 3-state
E8 U8 = 74xx-us:74*10: Triple 3-input NAND gate
E9 = 74xx-us:74*151: Data SELECTOR/MULTIPLEXER
E14 = atmel-cpld:ATF150X84: ATF150x in 84 pin package.
J1 = dec-con:QUAD: Quad-Height DEC board
J2 = con-lstb:MA04-1: PIN HEADER; OC_FARNELL: unknown; OC_NEWARK: unknown
J3 SV1 = con-lstb:MA03-2: PIN HEADER; OC_FARNELL: unknown; OC_NEWARK: unknown
J4 = dec-con:DEC40PIN: PIN HEADER
J5 = con-thomas-betts:D-SUB9-: D-Subminiatur Connector Source: Electronioc Interconnects European Edition 1998; OC_FARNELL: unknown; OC_NEWARK: unknown
OSC = crystal:QG5460: CRYSTAL RESONATOR; OC_FARNELL: unknown; OC_NEWARK: unknown
OSC1 = crystal:QG5860: CRYSTAL RESONATOR; OC_FARNELL: unknown; OC_NEWARK: unknown
Q1 Q2 = transistor:*-NPN-: NPN Transistror BF959 corrected 2008.03.06
Q3 = transistor:2N3904: NPN TRANSISTOR
R1-R22 R24 = rcl:R-US_: RESISTOR, American symbol
R23 = resistor-dil:8R-P: DIL RESISTOR
RN1 RN2 = resistor-sil:G08R: SIL RESISTOR; OC_FARNELL: unknown; OC_NEWARK: unknown
RN3 = resistor-sil:G10R: SIL RESISTOR; OC_FARNELL: unknown; OC_NEWARK: unknown
S1 = special:SW_DIP-8: DIP SWITCH
SERIAL = switch-dil:DP06: DIL/CODE SWITCH; MPN: MCDP06; OC_FARNELL: 9471618; OC_NEWARK: 26M1097
SV2 = con-harting-ml:ML10: HARTING; OC_FARNELL: unknown; OC_NEWARK: unknown
SW2 = switch-omron:10-XX: OMRON SWITCH; MPN: B3F-1000; OC_FARNELL: 176432; OC_NEWARK: 36M3542
SW3 = switch-dil:DIP04S: DIL/CODE SWITCH; OC_FARNELL: unknown; OC_NEWARK: unknown
TS_DISABLE = switch:9070-1W: TOGGLE SWITCH Marquardt
U1 = atmel:MEGA8-P: MICROCONTROLLER 8 Kbytes FLASH, 1 kbytes SRAM, 512 bytes EEPROM, USART, 4-channel 10 bit ADC, 2-channel 8 bit ADC Pin compatible with Atmega48, ATMega88, ATMega168 Source: avr.lbr; OC_FARNELL: unknown; OC_NEWARK: unknown
U2 = microchip:MCP23017: http://ww1.microchip.com/downloads/en/DeviceDoc/21952a.pdf Source: http://ww1.microchip.com/downloads/en/DeviceDoc/21952a.pdf; MF: MICROCHIP; MPN: MCP23017-E/SP; OC_FARNELL: 1332088; OC_NEWARK: 31K2959
U9 = 74xx-us:74*00: Quad 2-input NAND gate
U10 = maxim:MAX232: RS232 TRANSCEIVER; MF: MAXIM; MPN: MAX232ACPE+; OC_FARNELL: 9723773; OC_NEWARK: 68K4544
U11 = microchip:24*: Serial EEPROM I2C; MF: MICROCHIP; MPN: 24LC025-I/P; OC_FARNELL: unknown; OC_NEWARK: 92C7098
U$1 = dec-con:OUTLINE-*: Board outlines for DEC boards.
VCCINT VCCIO = dec-con:JUMPER: Normally closed SMD Jumper (Generates a DRC error.)
Y1 = crystal:CRYSTAL: CRYSTAL; OC_FARNELL: 1666973; OC_NEWARK: unknown

## Net classes
0 default: width 0.508 mm
1 supply: width 1.27 mm